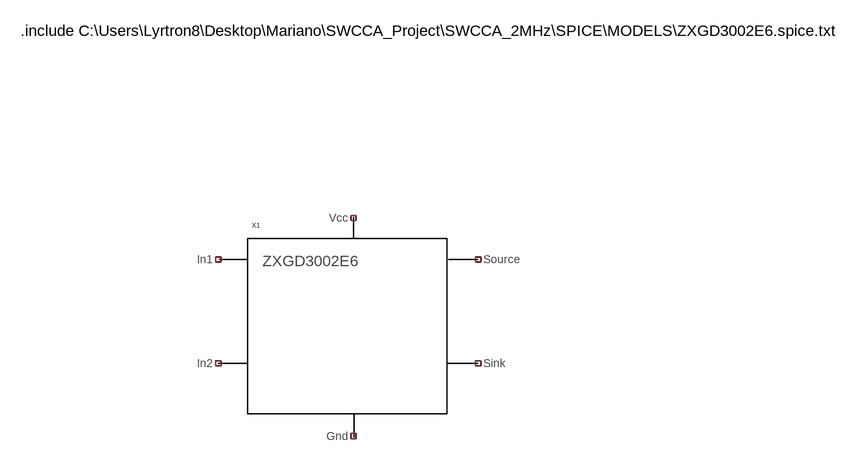
[diagram p0: schematic Draft1.asc]
Draft1.asc, the LTspice schematic file:
Version 4
SHEET 1 1112 680
SYMBOL ZXGD3002E6 256 208 R0
SYMATTR InstName X1
TEXT -256 -240 Left 2 !.include C:\\Users\\Lyrtron8\\Desktop\\Mariano\\SWCCA_Project\\SWCCA_2MHz\\SPICE\\MODELS\\ZXGD3002E6.spice.txt

The netlist it stands for:
* Draft1.asc
XX1 NC_01 NC_02 NC_03 NC_04 NC_05 NC_06 ZXGD3002E6  ; pins Vcc In1 Gnd Sink In2 Source
.include C:\Users\Lyrtron8\Desktop\Mariano\SWCCA_Project\SWCCA_2MHz\SPICE\MODELS\ZXGD3002E6.spice.txt
.backanno
.end